# Altium schematic sheet PX4FMUv2.4.6_01.SchDoc: PX4FMUv2.4.6.sch
size 282 x 200 mm; Date: 2015/3/26 21:06:14; SheetNumber: Sheet:
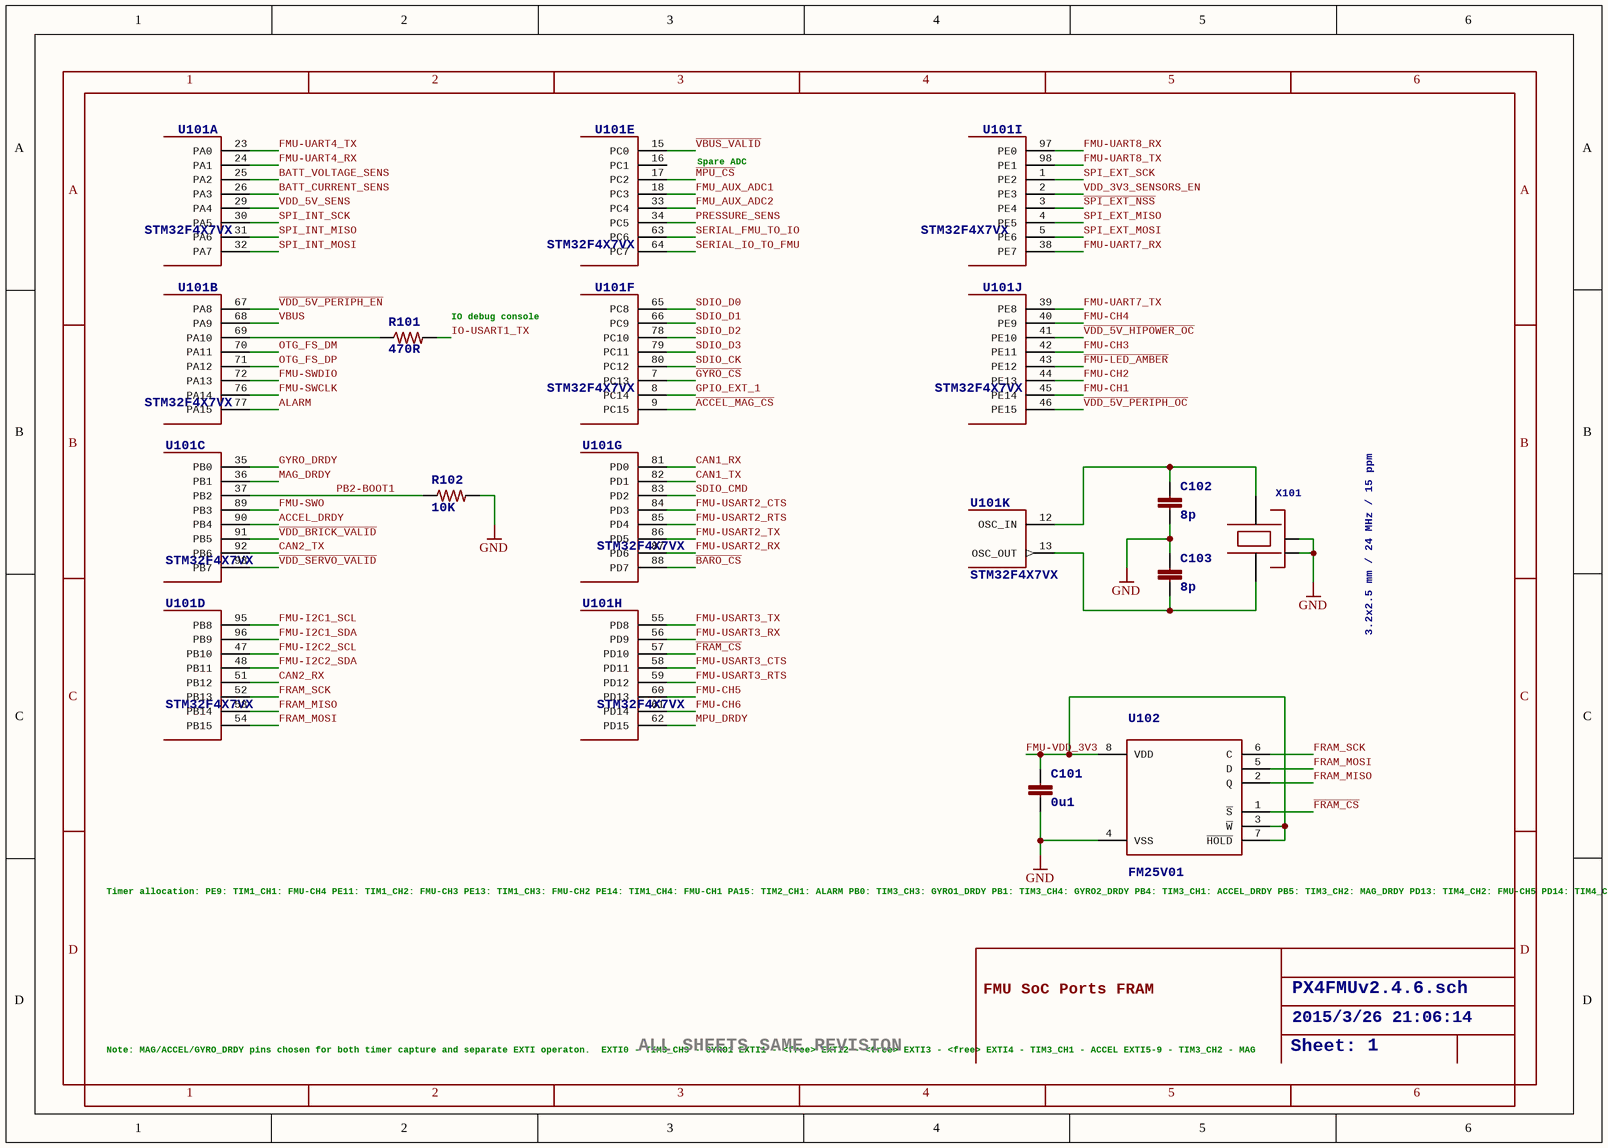
[diagram p0: PX4FMUv2.4.6_01.SchDoc]

## Parts
C101  0u1  [0402-CAP]
C102  8p  [0402-CAP]
C103  8p  [0402-CAP]
R101  470R  [0402-RES]
R102  10K  [0402-RES]
U101  STM32F4X7VX  [TQFP100]  (parts A,B,C,D,E,F,G,H,I,J,K of 14)
U102  FM25V01  [SO08]
X101  3.2x2.5 mm / 24 MHz / 15 ppm  [OSCILLATOR-3.2X2.5]

## Nets
GND: C101.P$2 C102.P$2 C103.P$1 R102.P$2 U102.4(VSS) X101.2(NC_2) X101.4(NC_4)
~{ACCEL_MAG_CS}: U101.9(PC15)
ACCEL_DRDY: U101.90(PB4)
ALARM: U101.77(PA15)
~{BARO_CS}: U101.88(PD7)
BATT_CURRENT_SENS: U101.26(PA3)
BATT_VOLTAGE_SENS: U101.25(PA2)
CAN1_RX: U101.81(PD0)
CAN1_TX: U101.82(PD1)
CAN2_RX: U101.51(PB12)
CAN2_TX: U101.92(PB6)
~{FMU-LED_AMBER}: U101.43(PE12)
~{FRAM_CS}: U101.57(PD10) U102.1(~{S})
FMU-CH1: U101.45(PE14)
FMU-CH2: U101.44(PE13)
FMU-CH3: U101.42(PE11)
FMU-CH4: U101.40(PE9)
FMU-CH5: U101.60(PD13)
FMU-CH6: U101.61(PD14)
FMU-I2C1_SCL: U101.95(PB8)
FMU-I2C1_SDA: U101.96(PB9)
FMU-I2C2_SCL: U101.47(PB10)
FMU-I2C2_SDA: U101.48(PB11)
FMU-SWCLK: U101.76(PA14)
FMU-SWDIO: U101.72(PA13)
FMU-SWO: U101.89(PB3)
FMU-UART4_RX: U101.24(PA1)
FMU-UART4_TX: U101.23(PA0)
FMU-UART7_RX: U101.38(PE7)
FMU-UART7_TX: U101.39(PE8)
FMU-UART8_RX: U101.97(PE0)
FMU-UART8_TX: U101.98(PE1)
FMU-USART2_CTS: U101.84(PD3)
FMU-USART2_RTS: U101.85(PD4)
FMU-USART2_RX: U101.87(PD6)
FMU-USART2_TX: U101.86(PD5)
FMU-USART3_CTS: U101.58(PD11)
FMU-USART3_RTS: U101.59(PD12)
FMU-USART3_RX: U101.56(PD9)
FMU-USART3_TX: U101.55(PD8)
FMU-VDD_3V3: C101.P$1 U102.3(~{W}) U102.7(~{HOLD}) U102.8(VDD)
FMU_AUX_ADC1: U101.18(PC3)
FMU_AUX_ADC2: U101.33(PC4)
FRAM_MISO: U101.53(PB14) U102.2(Q)
FRAM_MOSI: U101.54(PB15) U102.5(D)
FRAM_SCK: U101.52(PB13) U102.6(C)
~{GYRO_CS}: U101.7(PC13)
GPIO_EXT_1: U101.8(PC14)
GYRO_DRDY: U101.35(PB0)
IO-USART1_TX: R101.P$2
~{MPU_CS}: U101.17(PC2)
MAG_DRDY: U101.36(PB1)
MPU_DRDY: U101.62(PD15)
OTG_FS_DM: U101.70(PA11)
OTG_FS_DP: U101.71(PA12)
PB2-BOOT1: R102.P$1 U101.37(PB2)
PRESSURE_SENS: U101.34(PC5)
~{SPI_EXT_NSS}: U101.3(PE4)
SDIO_CK: U101.80(PC12)
SDIO_CMD: U101.83(PD2)
SDIO_D0: U101.65(PC8)
SDIO_D1: U101.66(PC9)
SDIO_D2: U101.78(PC10)
SDIO_D3: U101.79(PC11)
SERIAL_FMU_TO_IO: U101.63(PC6)
SERIAL_IO_TO_FMU: U101.64(PC7)
SPI_EXT_MISO: U101.4(PE5)
SPI_EXT_MOSI: U101.5(PE6)
SPI_EXT_SCK: U101.1(PE2)
SPI_INT_MISO: U101.31(PA6)
SPI_INT_MOSI: U101.32(PA7)
SPI_INT_SCK: U101.30(PA5)
~{VBUS_VALID}: U101.15(PC0)
~{VDD_5V_HIPOWER_OC}: U101.41(PE10)
~{VDD_5V_PERIPH_EN}: U101.67(PA8)
~{VDD_5V_PERIPH_OC}: U101.46(PE15)
~{VDD_BRICK_VALID}: U101.91(PB5)
~{VDD_SERVO_VALID}: U101.93(PB7)
VBUS: U101.68(PA9)
VDD_3V3_SENSORS_EN: U101.2(PE3)
VDD_5V_SENS: U101.29(PA4)
NetC102_P$1: C102.P$1 U101.12(OSC_IN) X101.3
NetC103_P$2: C103.P$2 U101.13(OSC_OUT) X101.1
NetR101_P$1: R101.P$1 U101.69(PA10)

Not connected (* = marked no-connect by the designer): U101 16(PC1)

## Notes on the sheet
- Spare ADC
- (near R101) IO debug console
- (near U102) Timer allocation:
  PE9: TIM1_CH1: FMU-CH4
  PE11: TIM1_CH2: FMU-CH3
  PE13: TIM1_CH3: FMU-CH2
  PE14: TIM1_CH4: FMU-CH1
  PA15: TIM2_CH1: ALARM
  PB0: TIM3_CH3: GYRO1_DRDY
  PB1: TIM3_CH4: GYRO2_DRDY
  PB4: TIM3_CH1: ACCEL_DRDY
  PB5: TIM3_CH2: MAG_DRDY
  PD13: TIM4_CH2: FMU-CH5
  PD14: TIM4_CH3: FMU-CH6
  PD15: TIM4_CH4: spare
- FMU SoC Ports
  FRAM
- Note: MAG/ACCEL/GYRO_DRDY pins chosen
  for both timer capture and separate
  EXTI operaton.
  EXTI0 - TIM3_CH3 - GYRO1
  EXTI1 - <free>
  EXTI2 - <free>
  EXTI3 - <free>
  EXTI4 - TIM3_CH1 - ACCEL
  EXTI5-9 - TIM3_CH2 - MAG
- ALL SHEETS SAME REVISION
- 1
- 2
- 3
- 4
- 5
- 6
- A
- B
- C
- D

## Library data of the parts
C101 = CAP0402: <b>Capacitor</b> / Standard 0603 ceramic capacitor, and 0.1" leaded capacitor.; PARTNO: CC0402ZRY5V7BB104
C102 C103 = CAP0402: <b>Capacitor</b> / Standard 0603 ceramic capacitor, and 0.1" leaded capacitor.; PARTNO: C1005C0G1H080C
R101 = RESISTOR0402-RES: <b>Resistor</b> / Basic schematic elements and footprints for 0603, 1206, and PTH 1/10th watt (small) resistors.; PARTNO: RC0402FR-07470RL
R102 = RESISTOR0402-RES: <b>Resistor</b> / Basic schematic elements and footprints for 0603, 1206, and PTH 1/10th watt (small) resistors.; PARTNO: RC0402FR-0710KL
U101 = STM32F4X7VX: STM32F4X7VX 100 pin LQFP / STM32F407VE - 512 KB flash, no crypto / STM32F407VG - 1 MB flash, no crypto / STM32F417VE - 512 KB flash, with crypto / STM32F417VG - 1 MB flash, with crypto; PARTNO: STM32F427VI
U102 = FM25V01: <b>FM25V01 128Kb Serial 3V F-RAM Memory</b>; PARTNO: FM25V01-G; DATASHEET: http://www.ramtron.com/files/datasheets/FM25V01_ds.pdf; LINK: http://www.digikey.com/product-detail/en/FM25V01-GTR/1140-1026-1-ND/2809832; MFGPN: FM25V01
X101 = OSCILLATOR-3.2X2.5: Crystal Oscillator in 3.2x2.5 SMD